# Altium schematic sheet Core.SchDoc
size A3; DocumentNumber: 5; SheetNumber: 5; SheetTotal: 7; PageSetup: Record=PageOptions|CenterHorizontal=True|CenterVertical=True|PrintScale=0.95|XCorrection=1.00|YCorrection=1.00|PrintKind=0|BorderSize=5000000|LeftOffset=0|BottomOffset=0|Orientation=2|PaperLength=2970|PaperWidth=2100|Scale=100|PaperSource=7|PrintQuality=600|MediaType=1|DitherType=10|PaperKind=A4|PrintScaleMode=1
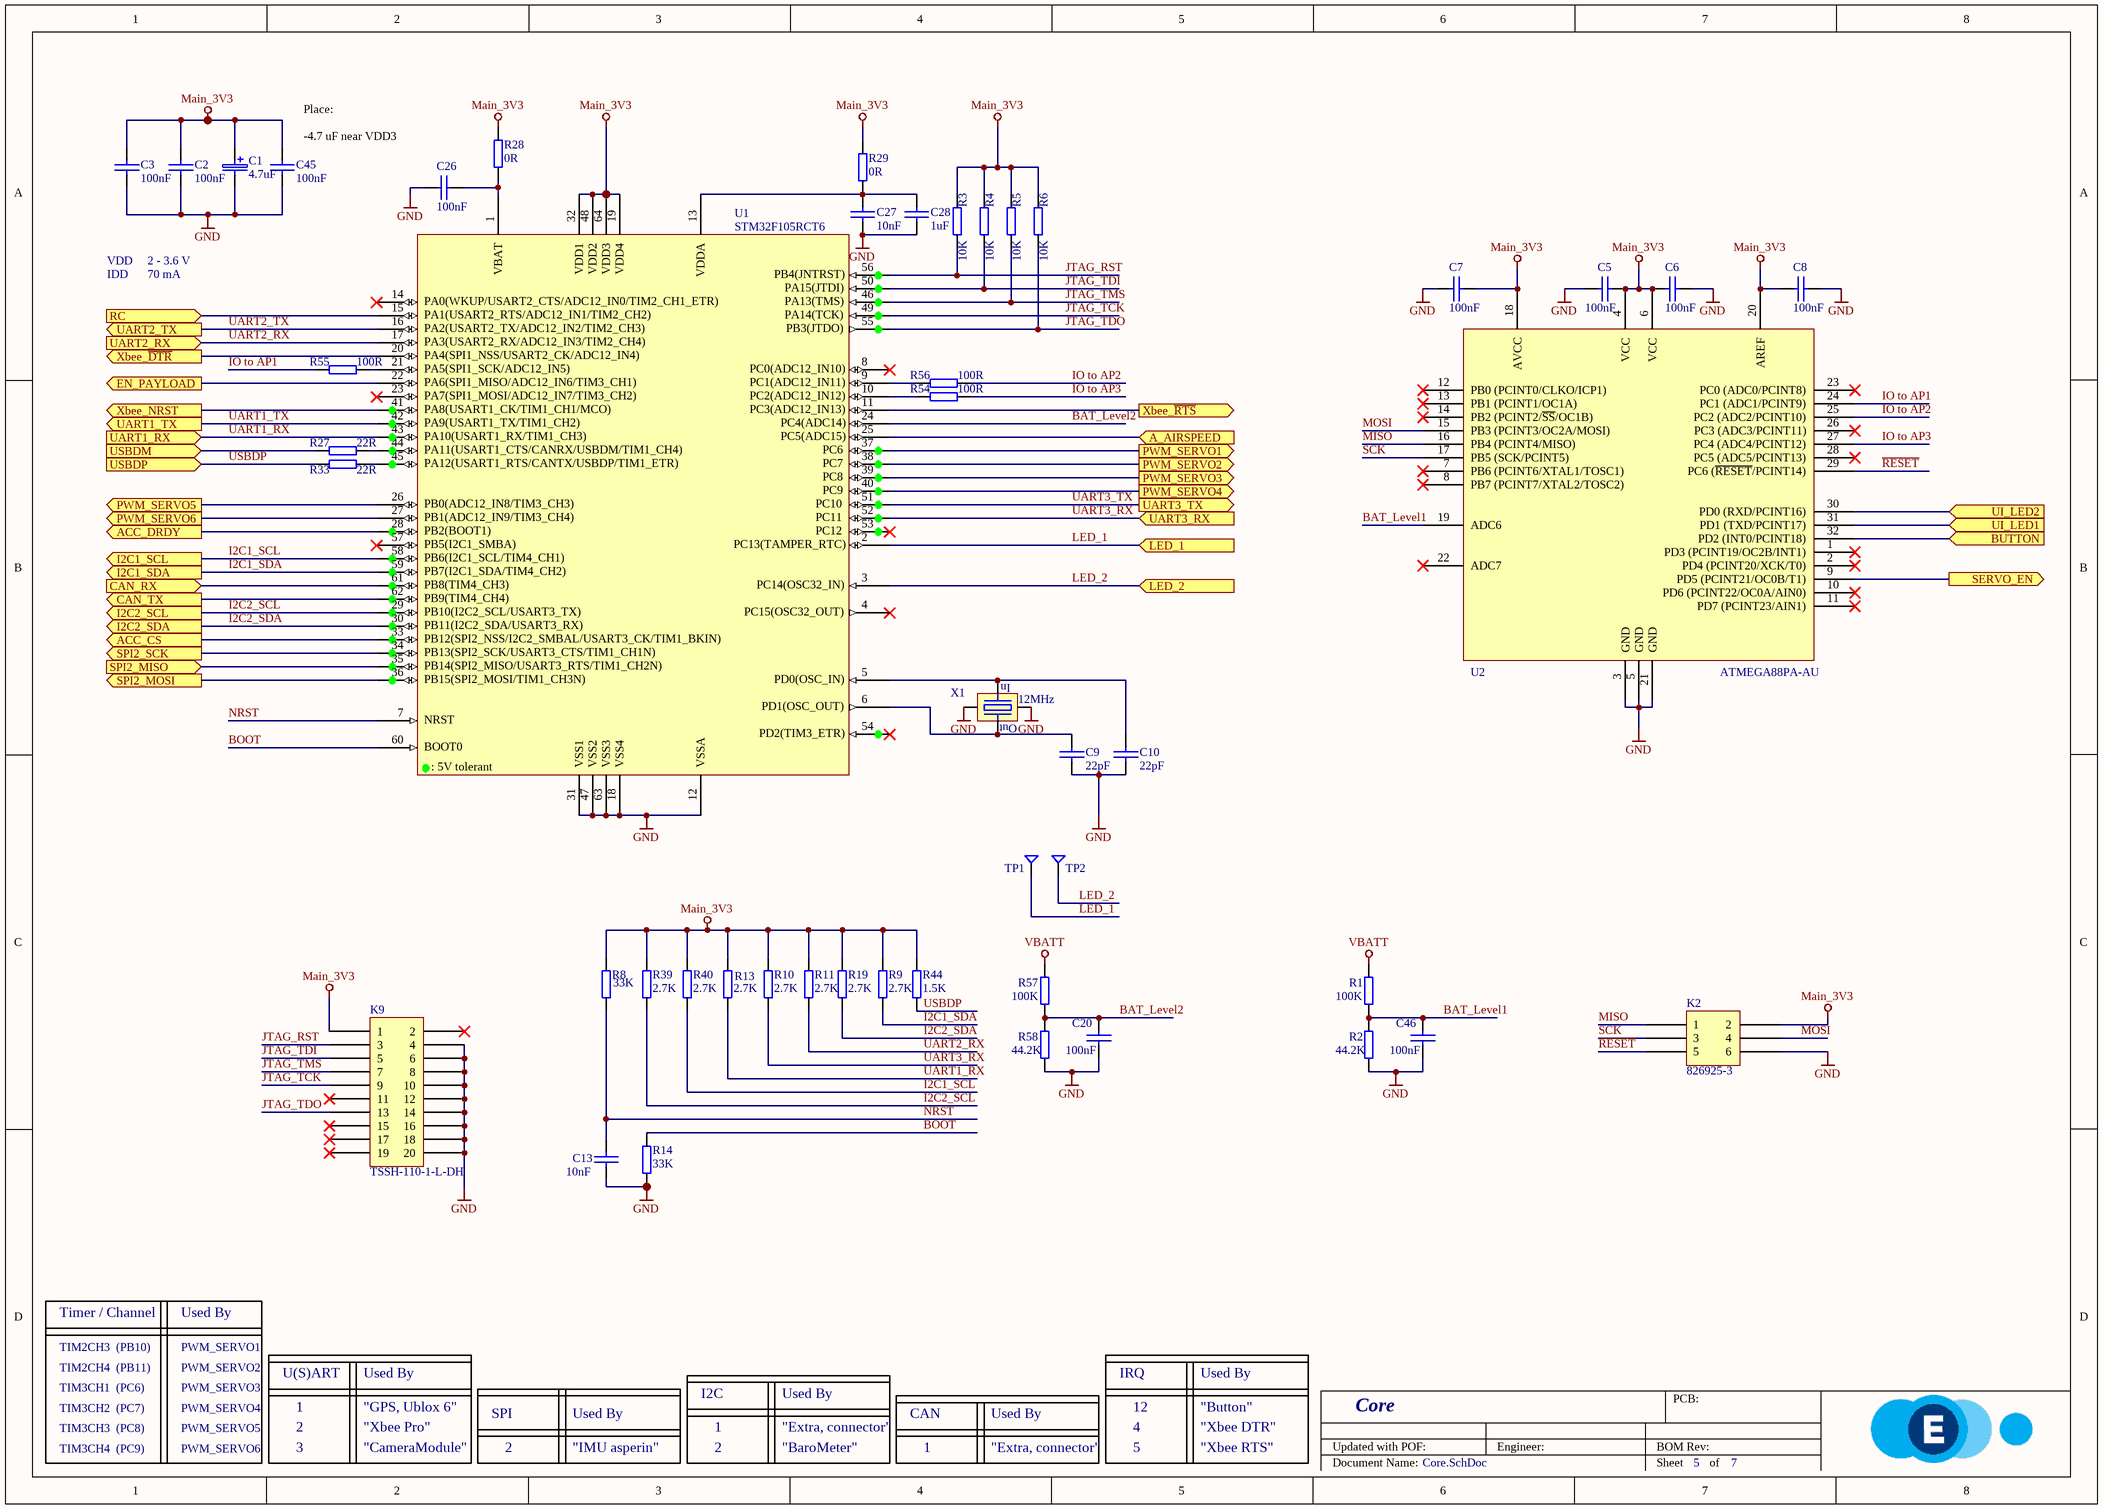
[diagram p0: Core.SchDoc]

## Parts
C1  value 4.7uF  [C_TANT_A_CAL]  (hidden comment: C12)
C2  value 100nF  [C0603_CAL]  (hidden comment: C11)
C3  value 100nF  [C0603_CAL]  (hidden comment: C11)
C5  value 100nF  [C0603_CAL]  (hidden comment: C11)
C6  value 100nF  [C0603_CAL]  (hidden comment: C11)
C7  value 100nF  [C0603_CAL]  (hidden comment: C11)
C8  value 100nF  [C0603_CAL]  (hidden comment: C11)
C9  value 22pF  [C0603_CAL]  (hidden comment: C11)
C10  value 22pF  [C0603_CAL]  (hidden comment: C11)
C13  value 10nF  [C0603_CAL]  (hidden comment: C11)
C20  value 100nF  [C0603_CAL]  (hidden comment: C11)
C26  value 100nF  [C0603_CAL]  (hidden comment: C11)
C27  value 10nF  [C0603_CAL]  (hidden comment: C11)
C28  value 1uF  [C0805_CAL]  (hidden comment: C11)
C45  value 100nF  [C0603_CAL]  (hidden comment: C11)
C46  value 100nF  [C0603_CAL]  (hidden comment: C11)
K2  826925-3  [6pins, two row]
K9  TSSH-110-1-L-DH  [TSSH-110-01-L-DH]
R1  value 100K  [R0603_CAL]  (hidden comment: R12)
R2  value 44.2K  [R0603_CAL]  (hidden comment: R12)
R3  value 10K  [R0603_CAL]  (hidden comment: R12)
R4  value 10K  [R0603_CAL]  (hidden comment: R12)
R5  value 10K  [R0603_CAL]  (hidden comment: R12)
R6  value 10K  [R0603_CAL]  (hidden comment: R12)
R8  value 33K  [R0603_CAL]  (hidden comment: R12)
R9  value 2.7K  [R0603_CAL]  (hidden comment: R12)
R10  value 2.7K  [R0603_CAL]  (hidden comment: R12)
R11  value 2.7K  [R0603_CAL]  (hidden comment: R12)
R13  value 2.7K  [R0603_CAL]  (hidden comment: R12)
R14  value 33K  [R0603_CAL]  (hidden comment: R12)
R19  value 2.7K  [R0603_CAL]  (hidden comment: R12)
R27  value 22R  [R0603_CAL]  (hidden comment: R12)
R28  value 0R  [R0603_CAL]  (hidden comment: R12)
R29  value 0R  [R0603_CAL]  (hidden comment: R12)
R33  value 22R  [R0603_CAL]  (hidden comment: R12)
R39  value 2.7K  [R0603_CAL]  (hidden comment: R12)
R40  value 2.7K  [R0603_CAL]  (hidden comment: R12)
R44  value 1.5K  [R0603_CAL]  (hidden comment: R12)
R54  value 100R  [R0603_CAL]  (hidden comment: R12)
R55  value 100R  [R0603_CAL]  (hidden comment: R12)
R56  value 100R  [R0603_CAL]  (hidden comment: R12)
R57  value 100K  [R0603_CAL]  (hidden comment: R12)
R58  value 44.2K  [R0603_CAL]  (hidden comment: R12)
TP1  PCB7  [TP_SMT_1.5MM]  (value not drawn)  (no BOM)
TP2  PCB7  [TP_SMT_1.5MM]  (value not drawn)  (no BOM)
U1  Man. Part no: STM32F105RCT6  [LQFP64]  (hidden comment: uC STM32F105RC)
U2  Man. Part no: ATMEGA88PA-AU  [TQFP32]  (hidden comment: ATMEGA88)
X1  Frequency: 12MHz  [ECS-120-20-33-CKM-TR]  (hidden comment: Crystal)

## Ports
A_AIRSPEED (in), ACC_CS (out), ACC_DRDY (out), BUTTON (in), CAN_RX (in), CAN_TX (out), EN_PAYLOAD (out), I2C1_SCL (out), I2C1_SDA (out), I2C2_SCL (out), I2C2_SDA (out), LED_1 (in), LED_2 (in), PWM_SERVO1 (out), PWM_SERVO2 (out), PWM_SERVO3 (out), PWM_SERVO4 (out), PWM_SERVO5 (out), PWM_SERVO6 (out), RC (in), SERVO_EN (out), SPI2_MISO (in), SPI2_MOSI (out), SPI2_SCK (out), UART1_RX (in), UART1_TX (out), UART2_RX (in), UART2_TX (out), UART3_RX (in), UART3_TX (out), UI_LED1 (in), UI_LED2 (in), USBDM (in), USBDP (in), Xbee_NRST (out), Xbee_~{DTR} (out), Xbee_~{RTS} (out)

## Nets
GND: C1.2 C2.1 C3.1 C5.1 C6.2 C7.1 C8.2 C9.1 C10.1 C13.1 C20.1 C26.1 C27.1 C28.1 C45.1 C46.1 K2.6 K9.4 K9.6 K9.8 K9.10 K9.12 K9.14 K9.16 K9.18 K9.20 R2.1 R14.1 R58.1 U1.12(VSSA) U1.18(VSS4) U1.31(VSS1) U1.47(VSS2) U1.63(VSS3) U2.3(GND) U2.5(GND) U2.21(GND) X1.2(GND) X1.4(GND)
Main_3V3: C1.1 C2.2 C3.2 C5.2 C6.1 C7.2 C8.1 C45.2 K2.2 K9.1 R3.2 R4.2 R5.2 R6.2 R8.2 R9.2 R10.2 R11.2 R13.2 R19.2 R28.2 R29.2 R39.2 R40.2 R44.2 U1.19(VDD4) U1.32(VDD1) U1.48(VDD2) U1.64(VDD3) U2.4(VCC) U2.6(VCC) U2.18(AVCC) U2.20(AREF)
VBATT: R1.2 R57.2
A_AIRSPEED: U1.25(PC5(ADC15)) ; port A_AIRSPEED
ACC_CS: U1.33 ; port ACC_CS
ACC_DRDY: U1.28(PB2(BOOT1)) ; port ACC_DRDY
BAT_Level1: C46.2 R1.1 R2.2 U2.19(ADC6)
BAT_Level2: C20.2 R57.1 R58.2 U1.24(PC4(ADC14))
BOOT: R14.2 U1.60(BOOT0)
BUTTON: U2.32(PD2_(INT0/PCINT18)) ; port BUTTON
CAN_RX: U1.61 ; port CAN_RX
CAN_TX: U1.62 ; port CAN_TX
EN_PAYLOAD: U1.22 ; port EN_PAYLOAD
I2C1_SCL: R40.1 U1.58(PB6(I2C1_SCL/TIM4_CH1)) ; port I2C1_SCL
I2C1_SDA: R9.1 U1.59 ; port I2C1_SDA
I2C2_SCL: R39.1 U1.29(PB10(I2C2_SCL/USART3_TX)) ; port I2C2_SCL
I2C2_SDA: R19.1 U1.30(PB11(I2C2_SDA/USART3_RX)) ; port I2C2_SDA
IO to AP1: R55.2 U2.24(PC1_(ADC1/PCINT9))
IO to AP2: R56.2 U2.25(PC2_(ADC2/PCINT10))
IO to AP3: R54.1 U2.27(PC4_(ADC4/PCINT12))
JTAG_RST: K9.3 R3.1 U1.56
JTAG_TCK: K9.9 U1.49(PA14(TCK))
JTAG_TDI: K9.5 R4.1 U1.50
JTAG_TDO: K9.13 R6.1 U1.55
JTAG_TMS: K9.7 R5.1 U1.46(PA13(TMS))
LED_1: TP1.1 U1.2(PC13(TAMPER_RTC)) ; port LED_1
LED_2: TP2.1 U1.3(PC14(OSC32_IN)) ; port LED_2
MISO: K2.1 U2.16(PB4_(PCINT4/MISO))
MOSI: K2.4 U2.15(PB3_(PCINT3/OC2A/MOSI))
NRST: C13.2 R8.1 U1.7(NRST)
PWM_SERVO1: U1.37 ; port PWM_SERVO1
PWM_SERVO2: U1.38 ; port PWM_SERVO2
PWM_SERVO3: U1.39 ; port PWM_SERVO3
PWM_SERVO4: U1.40 ; port PWM_SERVO4
PWM_SERVO5: U1.26 ; port PWM_SERVO5
PWM_SERVO6: U1.27 ; port PWM_SERVO6
~{RESET}: K2.5 U2.29(PC6_(~{RESET}/PCINT14))
RC: U1.15 ; port RC
SCK: K2.3 U2.17(PB5_(SCK/PCINT5))
SERVO_EN: U2.9(PD5_(PCINT21/OC0B/T1)) ; port SERVO_EN
SPI2_MISO: U1.35(PB14(SPI2_MISO/USART3_RTS/TIM1_CH2N)) ; port SPI2_MISO
SPI2_MOSI: U1.36 ; port SPI2_MOSI
SPI2_SCK: U1.34 ; port SPI2_SCK
UART1_RX: R13.1 U1.43(PA10(USART1_RX/TIM1_CH3)) ; port UART1_RX
UART1_TX: U1.42(PA9(USART1_TX/TIM1_CH2)) ; port UART1_TX
UART2_RX: R11.1 U1.17 ; port UART2_RX
UART2_TX: U1.16 ; port UART2_TX
UART3_RX: R10.1 U1.52 ; port UART3_RX
UART3_TX: U1.51 ; port UART3_TX
UI_LED1: U2.31(PD1_(TXD/PCINT17)) ; port UI_LED1
UI_LED2: U2.30(PD0_(RXD/PCINT16)) ; port UI_LED2
USBDM: R27.1 ; port USBDM
USBDP: R33.1 R44.1 ; port USBDP
Xbee_~{DTR}: U1.20 ; port Xbee_~{DTR}
Xbee_NRST: U1.41(PA8(USART1_CK/TIM1_CH1/MCO)) ; port Xbee_NRST
Xbee_~{RTS}: U1.11 ; port Xbee_~{RTS}
NetC9_2: C9.2 U1.6 X1.3(Out)
NetC10_2: C10.2 U1.5 X1.1(In)
NetC26_2: C26.2 R28.1 U1.1(VBAT)
NetC27_2: C27.2 C28.2 R29.1 U1.13(VDDA)
NetR27_2: R27.2 U1.44(PA11(USART1_CTS/CANRX/USBDM/TIM1_CH4))
NetR33_2: R33.2 U1.45(PA12(USART1_RTS/CANTX/USBDP/TIM1_ETR))
NetR54_2: R54.2 U1.10
NetR55_1: R55.1 U1.21
NetR56_1: R56.1 U1.9

Not connected (* = marked no-connect by the designer): K9 2* 11* 15* 17* 19*; U1 4(PC15(OSC32_OUT))* 8* 14* 23* 53* 54* 57*; U2 1(PD3_(PCINT19/OC2B/INT1))* 2(PD4_(PCINT20/XCK/T0))* 7(PB6_(PCINT6/XTAL1/TOSC1))* 8(PB7_(PCINT7/XTAL2/TOSC2))* 10(PD6_(PCINT22/OC0A/AIN0))* 11(PD7_(PCINT23/AIN1))* 12(PB0_(PCINT0/CLKO/ICP1))* 13(PB1_(PCINT1/OC1A))* 14(PB2_(PCINT2/~{SS}/OC1B))* 22(ADC7)* 23(PC0_(ADC0/PCINT8))* 26(PC3_(ADC3/PCINT11))* 28(PC5_(ADC5/PCINT13))*

## Notes on the sheet
- (near C45) Place:
  -4.7 uF near VDD3
- VDD
- IDD
- 2 - 3.6 V
- 70 mA
- Timer / Channel
- Used By
- TIM2CH3  (PB10)
- TIM2CH4  (PB11)
- TIM3CH1  (PC6)
- PWM_SERVO1
- PWM_SERVO2
- PWM_SERVO3
- U(S)ART
- I2C
- IRQ
- TIM3CH2  (PC7)
- TIM3CH3  (PC8)
- TIM3CH4  (PC9)
- PWM_SERVO4
- PWM_SERVO5
- PWM_SERVO6
- 2
- 3
- 1
- "Xbee Pro"
- "CameraModule"
- "GPS, Ublox 6"
- SPI
- "IMU asperin"
- "Extra, connector"
- "BaroMeter"
- CAN
- 4
- 12
- 5
- "Xbee DTR"
- "Button"
- "Xbee RTS"
- Updated with POF:
- Core
- Engineer:
- BOM Rev:
- PCB:
- Document Name:
- Sheet
- of
- (in symbol uC STM32F105RC) PB4(JNTRST); PA15(JTDI); PA0(WKUP/USART2_CTS/ADC12_IN0/TIM2_CH1_ETR); PA1(USART2_RTS/ADC12_IN1/TIM2_CH2); PA2(USART2_TX/ADC12_IN2/TIM2_CH3); PB3(JTDO); PA3(USART2_RX/ADC12_IN3/TIM2_CH4); PA4(SPI1_NSS/USART2_CK/ADC12_IN4); PA5(SPI1_SCK/ADC12_IN5); PC0(ADC12_IN10); PA6(SPI1_MISO/ADC12_IN6/TIM3_CH1); PC1(ADC12_IN11); PA7(SPI1_MOSI/ADC12_IN7/TIM3_CH2); PC2(ADC12_IN12); PC3(ADC12_IN13); PC6; PC7; PC8; PC9; PB0(ADC12_IN8/TIM3_CH3); PC10; PB1(ADC12_IN9/TIM3_CH4); PC11; PC12; PB5(I2C1_SMBA); PB7(I2C1_SDA/TIM4_CH2); PB8(TIM4_CH3); PB9(TIM4_CH4); PB12(SPI2_NSS/I2C2_SMBAL/USART3_CK/TIM1_BKIN); PB13(SPI2_SCK/USART3_CTS/TIM1_CH1N); PB15(SPI2_MOSI/TIM1_CH3N); PD0(OSC_IN); PD1(OSC_OUT); PD2(TIM3_ETR); : 5V tolerant

## Library data of the parts
C1 = C12: Capacitor, tantalum; Manufacturer: AVX; Man. Part no: TAJA475K010R; Helios ID: 20; SETable: C; Placed on PCB: Y; Tolerance: 10%; Voltage Rating: 10V; ESR: *; Material: Tantalum; Note: *; Ripple Current: *; Alternative Helios ID: *; Case: Case A; LibraryID: C12
C2 C3 C5-C8 C20 C26 C45 C46 = C11: Capacitor, ceramic; Voltage Rating: 50V; Tolerance: 10%; Helios ID: 15; Material: X7R; SETable: C; Placed on PCB: Y; ESR: *; Ripple Current: *; Alternative Helios ID: *; Case: 0603; LibraryID: C11
  C2 C3 C5-C8 C26 C45: Manufacturer: *; Man. Part no: *; Note: *
C9 C10 = C11: Capacitor, ceramic; Voltage Rating: 50V; Tolerance: 5%; Helios ID: 54; Material: C0G/NP0; SETable: C; Placed on PCB: Y; ESR: *; Ripple Current: *; Alternative Helios ID: *; Case: 0603; LibraryID: C11
C13 C27 = C11: Capacitor, ceramic; Voltage Rating: 50V; Tolerance: 10%; Helios ID: 13; Material: X7R; SETable: C; Placed on PCB: Y; Manufacturer: *; Man. Part no: *; Note: *; ESR: *; Ripple Current: *; Alternative Helios ID: *; Case: 0603; LibraryID: C11
C28 = C11: Capacitor, ceramic; Manufacturer: Kemet; Man. Part no: C0805C105K3RACTU; Voltage Rating: 25V; Tolerance: 10%; Helios ID: 37; Material: X7R; SETable: C; Placed on PCB: Y; Note: *; ESR: *; Ripple Current: *; Alternative Helios ID: *; Case: 0805; LibraryID: C11
K2 = 826925-3: 2x3 way, header, 2,54mm; Manufacturer: TE Connectivity / AMP; Helios ID: 0; SETable: K; Placed on PCB: Y; Pitch: 2.54; No. of Contacts: 6; Current Rating: 3A; Case: TH; Man. Part no: 826925-3; Material: Tin; Gender: Header
K9 = TSSH-110-1-L-DH: Header, 2,54mm, Shrouded, 2x10way; Manufacturer: Samtec; Man. Part no: EJH-110-1-F-D-TH; Helios ID: 0; SETable: K; Placed on PCB: Y; Pitch: 2.54; No. of Contacts: 20; Current Rating: 6A; Case: TH; Material: Gold; Gender: Header
R1 R57 = R12: Resistor; Tolerance: 1%; SETable: R; Power Rating: 0.063W; Placed on PCB: Y; Voltage Rating: 50V; Helios ID: 19; Manufacturer: *; Man. Part no: *; Note: *; Alternative Helios ID: *; Case: 0603; LibraryID: R12
R2 R58 = R12: Resistor; Tolerance: 1%; SETable: R; Power Rating: 0.063W; Placed on PCB: Y; Voltage Rating: 50V; Helios ID: 108; Manufacturer: *; Man. Part no: *; Note: *; Alternative Helios ID: *; Case: 0603; LibraryID: R12
R3-R6 = R12: Resistor; Tolerance: 1%; SETable: R; Power Rating: 0.063W; Placed on PCB: Y; Voltage Rating: 50V; Helios ID: 22; Manufacturer: *; Man. Part no: *; Note: *; Alternative Helios ID: *; Material: *; Case: 0603; LibraryID: R12
R8 R14 = R12: Resistor; Tolerance: 1%; SETable: R; Power Rating: 0.063W; Placed on PCB: Y; Voltage Rating: 50V; Helios ID: 13; Manufacturer: *; Man. Part no: *; Note: *; Alternative Helios ID: *; Case: 0603; LibraryID: R12
R9-R11 R13 R19 R39 R40 = R12: Resistor; Tolerance: 1%; SETable: R; Power Rating: 0.063W; Placed on PCB: Y; Voltage Rating: 50V; Helios ID: 18; Manufacturer: *; Man. Part no: *; Note: *; Alternative Helios ID: *; Case: 0603; LibraryID: R12
R27 R33 = R12: Resistor; Tolerance: 1%; SETable: R; Power Rating: 0.063W; Placed on PCB: Y; Voltage Rating: 50V; Helios ID: 98; Manufacturer: *; Man. Part no: *; Note: *; Alternative Helios ID: *; Case: 0603; LibraryID: R12
R28 R29 = R12: Resistor; Tolerance: 1%; SETable: R; Power Rating: 0.063W; Placed on PCB: Y; Voltage Rating: 50V; Helios ID: 25; Manufacturer: *; Man. Part no: *; Note: *; Alternative Helios ID: *; Case: 0603; LibraryID: R12
  R28: Material: *
R44 = R12: Resistor; Tolerance: 1%; SETable: R; Power Rating: 0.063W; Placed on PCB: Y; Voltage Rating: 50V; Helios ID: 46; Manufacturer: *; Man. Part no: *; Note: *; Alternative Helios ID: *; Case: 0603; LibraryID: R12
R54-R56 = R12: Resistor; Tolerance: 1%; SETable: R; Power Rating: 0.063W; Placed on PCB: N; Voltage Rating: 50V; Helios ID: 31; Manufacturer: *; Man. Part no: *; Note: *; Alternative Helios ID: *; Case: 0603; LibraryID: R12
TP1 TP2 = PCB7: Testpad; SETable: PCB; Helios ID: 7; Placed on PCB: NP; Alternative Helios ID: *; LibraryID: PCB7
U1 = uC STM32F105RC: Microcontroller, ARM 32-bit, Mainstream; Manufacturer: ST; Helios ID: 0; Placed on PCB: Y; SETable: U; Note: *; Alternative Helios ID: *; Case: LQFP64; Type: Microcontroller
U2 = ATMEGA88: ATMEL - ATMEGA88PA-AU - MCU, 8BIT, AVR, 8K FLASH, 32 TQFP; Pitch: 0.8mm; Helios ID: 0; SETable: K; No. of Contacts: 32; Placed on PCB: Y; Manufacturer: ATMEL; Current Rating: *; Note: *; Voltage Rating: *; Gender: *; Alternative Helios ID: *; Case: TQFP 32
X1 = Crystal: CRYSTAL 12.000 MHZ 20PF SMD; Manufacturer: ECS Inc; Helios ID: 0; SETable: X; Placed on PCB: Y; Man. Part no: ECS-120-20-33-CKM-TR; C load: 20pF; Note: *; Alternative Helios ID: *; Case: ECX32 SMD; LibraryID: *